# Altium schematic sheet SM2_GPS_Module.SchDoc
size A
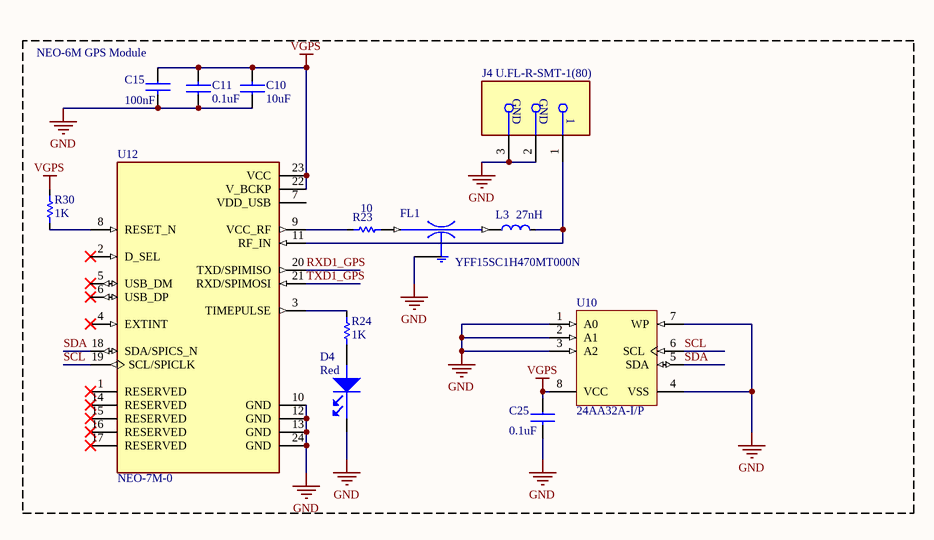
[diagram p0: SM2_GPS_Module.SchDoc]

## Parts
C10  10uF  [CAPC1005X56N]
C11  0.1uF  [CAPC1005X56N]
C15  100nF  [CAPC1005X56N]
C25  0.1uF  [CAPC1005X56N]
D4  value Red  [LED1608X55N-RED]  (hidden comment: LED_0603)
FL1  YFF15SC1H470MT000N  [FIL_YFF15SC1H470MT000N]
J4  U.FL-R-SMT-1(80)  [FP-U_FL-R-SMT-1_80-MFG]
L3  value 27nH  [RESC1005X40L]  (hidden comment: Inductor)
R23  value 10  [RESC1005X40L]  (hidden comment: 22R)
R24  1K  [RESC1005X40L]
R30  1K  [RESC1005X40L]
U10  24AA32A-I/P  [PDIP300-P8]
U12  NEO-7M-0  [XCVR_NEO-7M-0]

## Blocks framed on the sheet
NEO-6M GPS Module: C10 C11 C15 C25 D4 FL1 J4 L3 R23 R24 R30 U10 U12

## Nets
GND: C10.1 C11.1 C15.2 C25.2 D4.1(CATHODE) FL1.3(GND) J4.2(GND) J4.3(GND) U10.1(A0) U10.2(A1) U10.3(A2) U10.4(VSS) U10.7(WP) U12.10(GND) U12.12(GND) U12.13(GND) U12.24(GND)
VGPS: C10.2 C11.2 C15.1 C25.1 R30.1 U10.8(VCC) U12.22(V_BCKP) U12.23(VCC)
RXD1_GPS: U12.20(TXD/SPIMISO)
SCL: U10.6(SCL) U12.19(SCL/SPICLK)
SDA: U10.5(SDA) U12.18(SDA/SPICS_N)
TXD1_GPS: U12.21(RXD/SPIMOSI)
NetD4_2: D4.2(ANODE) R24.2
NetFL1_1: FL1.1(IN) R23.2
NetFL1_2: FL1.2(OUT) L3.1
NetJ4_1: J4.1 L3.2 U12.11(RF_IN)
NetR23_1: R23.1 U12.9(VCC_RF)
NetR24_1: R24.1 U12.3(TIMEPULSE)
NetR30_2: R30.2 U12.8(RESET_N)

Not connected (* = marked no-connect by the designer): U12 1(RESERVED)* 2(D_SEL)* 4(EXTINT)* 5(USB_DM)* 6(USB_DP)* 7(VDD_USB) 14(RESERVED)* 15(RESERVED)* 16(RESERVED)* 17(RESERVED)*

## Library data of the parts
C10 C11 C15 C25 = CAP_0402: CAP CER 0.1uF 16V 0402; PartNumber: TCC0402X5R104M160AT; Manufacturer: CCTC; Vendor: LCSC
  C10: Value: 10uF
  C11 C25: Value: 0.1uF
  C15: Value: 100nF
D4 = LED_0603: LED RED CLEAR 0603 SMD; Manufacturer: FNO; PartNumber: FC-DA1608HRK-620D; Vendor: LCSC
J4 = CMP-11598-000004-1: CONN U.FL RCPT STR 50 OHM SMD; Mating Cycles: 30; Impedance: 50R; Body Plating: Silver; Center Contact Plating: Gold; Body Material: Bronze; Dielectric Material: Polymer; Connector Type: Receptacle; Number of Ports: 1; Max Frequency: 6GHz; Mount: Surface Mount; Termination: Solder; Case/Package: SMD/SMT; Min Operating Temperature: -40°C; Series: U.FL; Max Operating Temperature: 90°C; Fastening Type: SNAP-ON; RoHS Compliant: Yes; Packaging: Tape and Reel; Package Quantity: 10000; Contact Material: Brass; Housing Color: Beige; Lead Free: Lead Free
L3 = Inductor: Inductor 1.8nH 0402; PartNumber: BKW0603UC1N8KGT; Manufacturer: GFBE; Vendor: LCSC
R23 R24 R30 = RES_0603: RES SMD 100K OHM 0402; Manufacturer: Uniroyal Elec; PartNumber: 0402WGF1003TCE; Vendor: LCSC
  R24 R30: Value: 1K
U10 = CMP-0159-00068-1: 32Kbit, 400kHz, 1.7V, I2C Serial EEPROM, 8-Pin PDIP, Industrial Temperature; PackageDescription: 8-Lead Plastic Dual In-Line (P) - 300 mil Body [PDIP]; Code_JEDEC: MS-001; PackageVersion: revBB, Aug-2009; DatasheetVersion: revJ, Feb-2009; PackageReference: PDIP300-P8
U12 = NEO-7M-0: series RF Receiver GLONASS, GNSS, GPS 1.575GHz -161dBm - - -; MF: U-Blox America; SnapEDA_Link: https://www.snapeda.com/parts/NEO-7M-0/U-Blox+America+Inc./view-part/?ref=snap; Package: SMD-24 U-Blox America Inc.; Value: *; MP: NEO-7M-0; Check_prices: https://www.snapeda.com/parts/NEO-7M-0/U-Blox+America+Inc./view-part/?ref=eda
FL1 = YFF15SC1H470MT000N: Availability: Unavailable; Value: *; Package: None; Price: None; MP: YFF15SC1H470MT000N